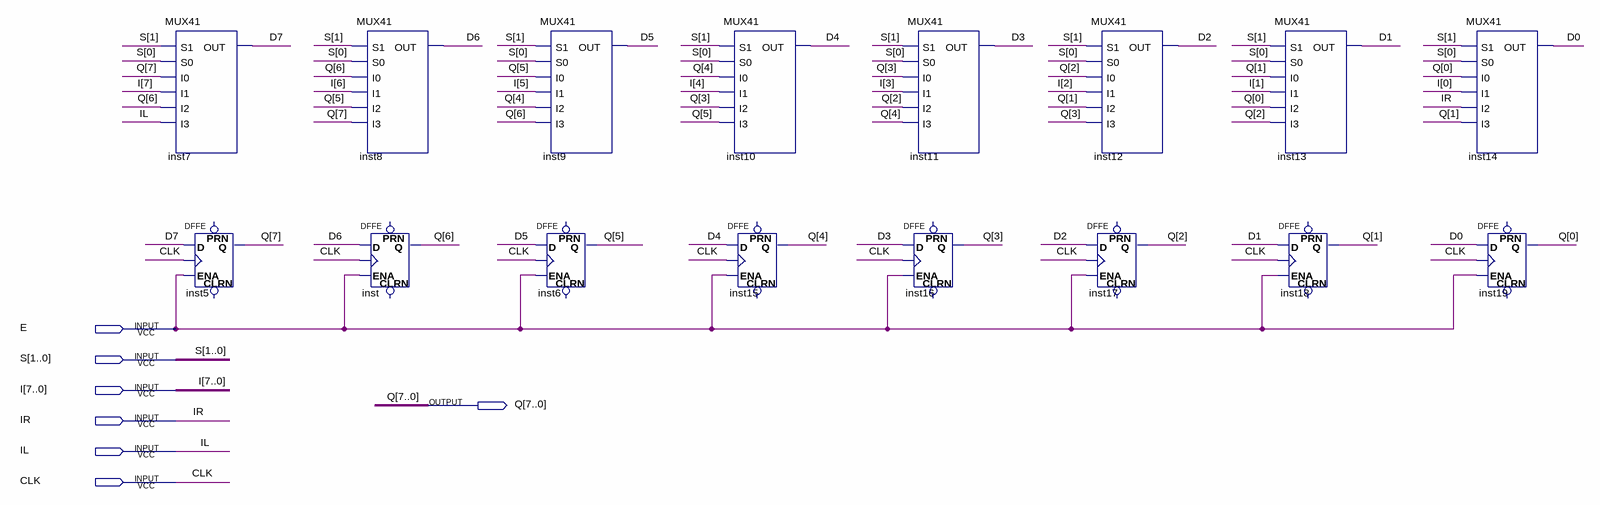
[diagram p0: schematic sheet]
// Quartus schematic SRwPL.bdf as structural Verilog: 16 symbols, 7 pins
module SRwPL (
  input  E,
  input  [1:0] S,
  input  [7:0] I,
  input  IR,
  input  IL,
  input  CLK,
  output [7:0] Q
);

  wire D0, D1, D2, D3, D4, D5, D6, D7;

  MUX41 inst7 (.S1(S[1]), .S0(S[0]), .I0(Q[7]), .I1(I[7]), .I2(Q[6]), .I3(IL), .OUT(D7));
  DFFE inst5 (.D(D7), .CLK(CLK), .ENA(E), .Q(Q[7]));  // open: PRN, CLRN
  MUX41 inst8 (.S1(S[1]), .S0(S[0]), .I0(Q[6]), .I1(I[6]), .I2(Q[5]), .I3(Q[7]), .OUT(D6));
  DFFE inst (.D(D6), .CLK(CLK), .ENA(E), .Q(Q[6]));  // open: PRN, CLRN
  MUX41 inst9 (.S1(S[1]), .S0(S[0]), .I0(Q[5]), .I1(I[5]), .I2(Q[4]), .I3(Q[6]), .OUT(D5));
  DFFE inst6 (.D(D5), .CLK(CLK), .ENA(E), .Q(Q[5]));  // open: PRN, CLRN
  MUX41 inst10 (.S1(S[1]), .S0(S[0]), .I0(Q[4]), .I1(I[4]), .I2(Q[3]), .I3(Q[5]), .OUT(D4));
  DFFE inst15 (.D(D4), .CLK(CLK), .ENA(E), .Q(Q[4]));  // open: PRN, CLRN
  MUX41 inst11 (.S1(S[1]), .S0(S[0]), .I0(Q[3]), .I1(I[3]), .I2(Q[2]), .I3(Q[4]), .OUT(D3));
  DFFE inst16 (.D(D3), .CLK(CLK), .ENA(E), .Q(Q[3]));  // open: PRN, CLRN
  MUX41 inst12 (.S1(S[1]), .S0(S[0]), .I0(Q[2]), .I1(I[2]), .I2(Q[1]), .I3(Q[3]), .OUT(D2));
  DFFE inst17 (.D(D2), .CLK(CLK), .ENA(E), .Q(Q[2]));  // open: PRN, CLRN
  MUX41 inst13 (.S1(S[1]), .S0(S[0]), .I0(Q[1]), .I1(I[1]), .I2(Q[0]), .I3(Q[2]), .OUT(D1));
  DFFE inst18 (.D(D1), .CLK(CLK), .ENA(E), .Q(Q[1]));  // open: PRN, CLRN
  MUX41 inst14 (.S1(S[1]), .S0(S[0]), .I0(Q[0]), .I1(I[0]), .I2(IR), .I3(Q[1]), .OUT(D0));
  DFFE inst19 (.D(D0), .CLK(CLK), .ENA(E), .Q(Q[0]));  // open: PRN, CLRN
endmodule
